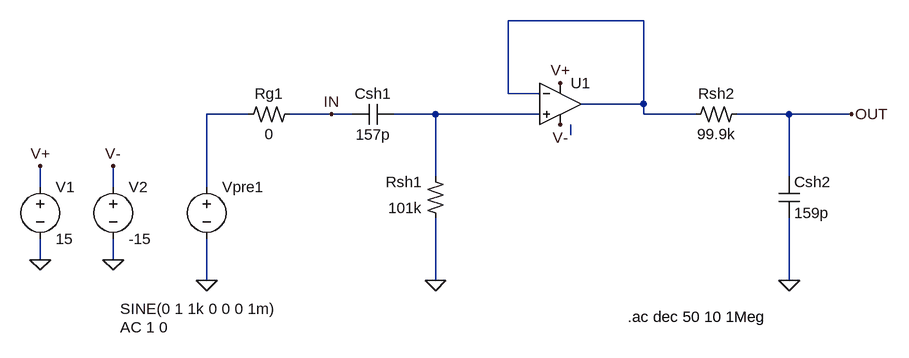
[diagram p0: schematic Shaper_frequency.asc]
Shaper_frequency.asc, the LTspice schematic file:
Version 4
SHEET 1 880 680
WIRE 448 -112 240 -112
WIRE 240 0 240 -112
WIRE 288 0 240 0
WIRE 448 16 448 -112
WIRE 448 16 352 16
WIRE -160 32 -224 32
WIRE -32 32 -96 32
WIRE 0 32 -32 32
WIRE 128 32 64 32
WIRE 288 32 128 32
WIRE 448 32 448 16
WIRE 528 32 448 32
WIRE 672 32 592 32
WIRE 768 32 672 32
WIRE 336 64 336 48
WIRE 128 128 128 32
WIRE 672 128 672 32
WIRE -480 144 -480 112
WIRE -368 144 -368 112
WIRE -224 144 -224 32
WIRE -480 256 -480 224
WIRE -368 256 -368 224
WIRE -224 288 -224 224
WIRE 128 288 128 192
WIRE 672 288 672 192
FLAG -480 256 0
FLAG -368 256 0
FLAG -480 112 V+
FLAG -368 112 V-
FLAG 320 48 V-
FLAG 320 -16 V+
FLAG -224 288 0
FLAG 128 288 0
FLAG 672 288 0
FLAG 768 32 OUT
FLAG -32 32 IN
SYMBOL voltage -480 128 R0
WINDOW 123 24 126 Left 2
WINDOW 39 24 111 Left 2
SYMATTR InstName V1
SYMATTR Value 15
SYMBOL voltage -368 128 R0
WINDOW 123 24 126 Left 2
WINDOW 39 24 111 Left 2
SYMATTR InstName V2
SYMATTR Value -15
SYMBOL Opamps/UniversalOpamp2 320 16 R0
SYMATTR InstName U1
SYMBOL res2 -96 16 R90
WINDOW 0 0 32 VBottom 2
WINDOW 3 31 32 VTop 2
SYMATTR InstName Rg1
SYMATTR Value 0
SYMBOL voltage -224 128 R0
WINDOW 3 -133 204 Left 2
WINDOW 123 -133 232 Left 2
WINDOW 39 0 0 Left 0
SYMATTR Value SINE(0 1 1k 0 0 0 1m)
SYMATTR Value2 AC 1 0
SYMATTR InstName Vpre1
SYMBOL cap 64 16 R90
WINDOW 0 0 32 VBottom 2
WINDOW 3 32 32 VTop 2
SYMATTR InstName Csh1
SYMATTR Value 157p
SYMBOL res2 144 192 R180
WINDOW 0 36 56 Left 2
WINDOW 3 36 16 Left 2
SYMATTR InstName Rsh1
SYMATTR Value 101k
SYMBOL res2 592 16 R90
WINDOW 0 0 32 VBottom 2
WINDOW 3 31 32 VTop 2
SYMATTR InstName Rsh2
SYMATTR Value 99.9k
SYMBOL cap 656 128 R0
SYMATTR InstName Csh2
SYMATTR Value 159p
TEXT 424 344 Left 2 !.ac dec 50 10 1Meg

The netlist it stands for:
* Shaper_frequency.asc
V1 V+ 0 15
V2 V- 0 -15
XU1 N003 N001 V+ V- N001 level.2 Avol=1Meg GBW=10Meg Slew=10Meg ilimit=25m rail=0 Vos=0 phimargin=45 en=0 enk=0 in=0 ink=0 Rin=500Meg  ; pins IN+ IN- V+ V- OUT
Rg1 IN N002 0
Vpre1 N002 0 SINE(0 1 1k 0 0 0 1m) AC 1 0
Csh1 N003 IN 157p
Rsh1 0 N003 101k
Rsh2 OUT N001 99.9k
Csh2 OUT 0 159p
.ac dec 50 10 1Meg
.lib UniversalOpamps2.sub
.backanno
.end